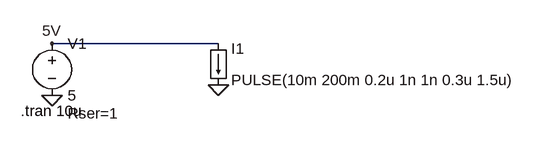
[diagram p0: schematic power_filter.asc]
power_filter.asc, the LTspice schematic file:
Version 4
SHEET 1 932 680
WIRE 432 144 176 144
FLAG 176 224 0
FLAG 176 144 5V
FLAG 432 208 0
SYMBOL voltage 176 128 R0
WINDOW 123 0 0 Left 0
WINDOW 39 24 124 Left 2
SYMATTR InstName V1
SYMATTR Value 5
SYMATTR SpiceLine Rser=1
SYMBOL load 416 144 R0
WINDOW 123 0 0 Left 0
WINDOW 39 0 0 Left 0
SYMATTR InstName I1
SYMATTR Value PULSE(10m 200m 0.2u 1n 1n 0.3u 1.5u)
TEXT 128 248 Left 2 !.tran 10u

The netlist it stands for:
* power_filter.asc
V1 5V 0 5 Rser=1
I1 5V 0 PULSE(10m 200m 0.2u 1n 1n 0.3u 1.5u)
.tran 10u
.backanno
.end